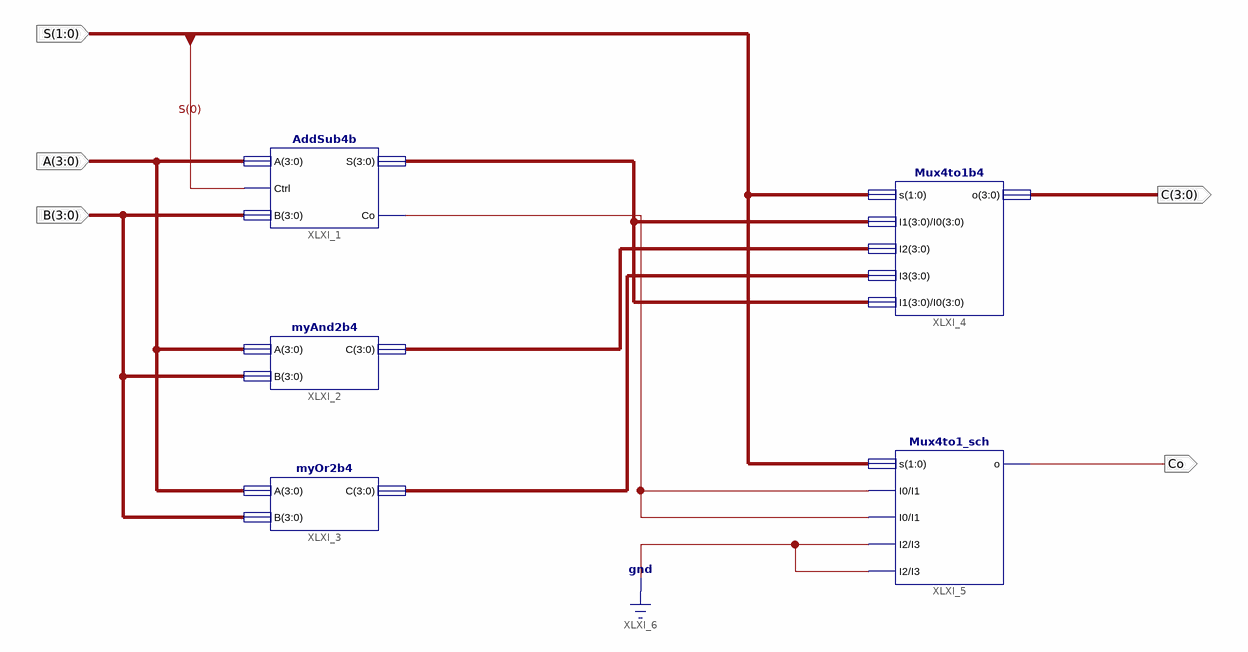
[diagram p0: schematic sheet 1]
// Xilinx ISE schematic myALU.sch (kintex7) as structural Verilog: 5 symbols, 5 ports
module myALU (
  input  [1:0] S,
  input  [3:0] A,
  input  [3:0] B,
  output [3:0] C,
  output Co
);

  wire XLXN_9;
  wire [3:0] XLXN_5, XLXN_7, XLXN_8;

  AddSub4b XLXI_1 (.A(A), .Ctrl(S[0]), .B(B), .S(XLXN_5), .Co(XLXN_9));
  myAnd2b4 XLXI_2 (.A(A), .B(B), .C(XLXN_8));
  myOr2b4 XLXI_3 (.A(A), .B(B), .C(XLXN_7));
  Mux4to1b4 XLXI_4 (.s(S), .I1(XLXN_5), .I2(XLXN_8), .I3(XLXN_7), .I0(XLXN_5), .o(C));
  Mux4to1_sch XLXI_5 (.s(S), .I0(XLXN_9), .I1(XLXN_9), .I2(1'b0), .I3(1'b0), .o(Co));
endmodule
